# EAGLE design headlightsV1_6 (EAGLE 7.5.0)
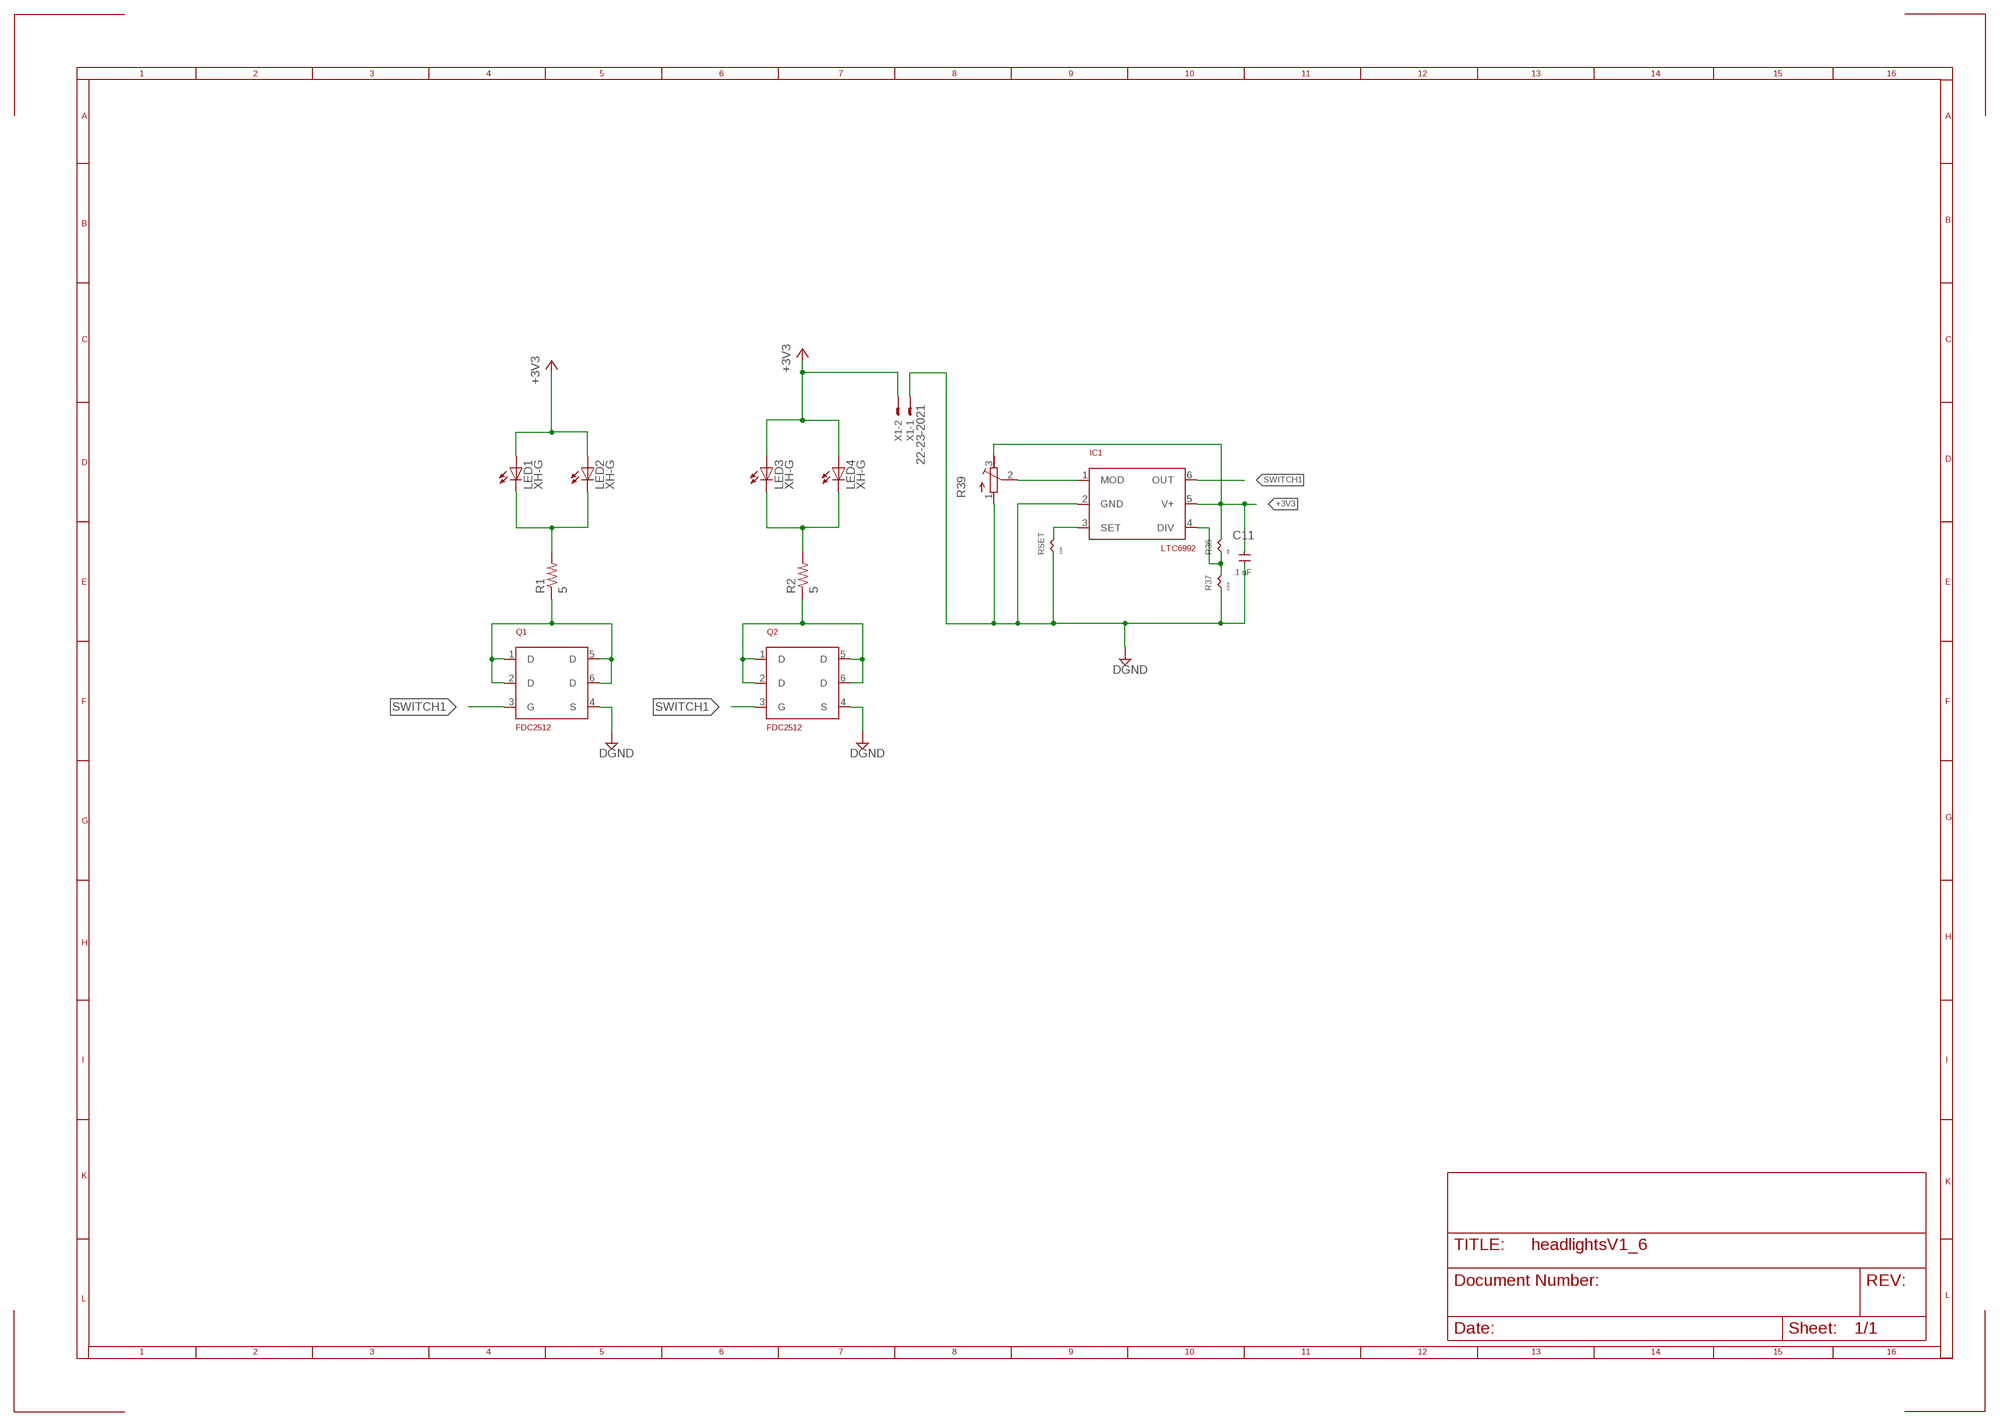
[diagram p0: schematic, sheet 1]

## Parts
C11  .1 uF  C-ERC0402  [C0402]
IC1  LTC6992  [TSOT-23-6]
LED1  XH-G  [XH-G]
LED2  XH-G  [XH-G]
LED3  XH-G  [XH-G]
LED4  XH-G  [XH-G]
Q1  FDC2512  [SSOT6]
Q2  FDC2512  [SSOT6]
R1  5  R-US_R0805  [R0805]
R2  5  R-US_R0805  [R0805]
R36  10k  R-ER-TINYR402  [R0402]
R37  6.81k  R-ER-TINYR402  [R0402]
R39  R-TRIMM3304W  [RTRIM3304W]
RSET  122k  R-ER-TINYR402  [R0402]
X1  22-23-2021  [22-23-2021]

## Nets
+3V3: C11.2 IC1.5(V+) LED1.2(A) LED2.2(A) LED3.2(A) LED4.2(A) R36.2 R39.3(A) X1.2
DGND: C11.1 IC1.2(GND) Q1.4(S) Q2.4(S) R37.1 R39.1(E) RSET.1 X1.1
N$1: Q1.1(D) Q1.2(D) Q1.5(D) Q1.6(D) R1.1
N$4: Q2.1(D) Q2.2(D) Q2.5(D) Q2.6(D) R2.1
N$39: LED3.1(C) LED4.1(C) R2.2
N$41: IC1.4(DIV) R36.1 R37.2
N$43: IC1.3(SET) RSET.2
N$45: IC1.1(MOD) R39.2(S)
N$57: LED1.1(C) LED2.1(C) R1.2
SWITCH1: IC1.6(OUT) Q1.3(G) Q2.3(G)

## Library data of the parts
C11 = rcl:C-ER
IC1 = linear-technology:LTC6992
LED1-LED4 = led:XH-G
Q1 Q2 = transistor-fet:FDC2512
R1 R2 = rcl:R-US_: RESISTOR, American symbol
R36 R37 RSET = rcl:R-ER-TINY
R39 = rcl:R-TRIMM: Trimm resistor
X1 = con-molex:22-23-2021: .100" (2.54mm) Center Header - 2 Pin

## Board
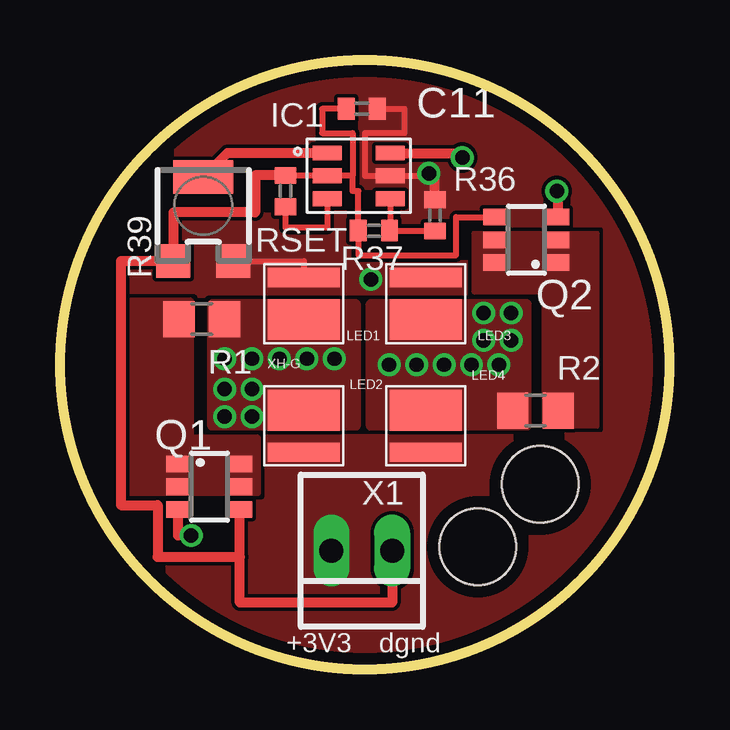
[diagram p1: board, top side]
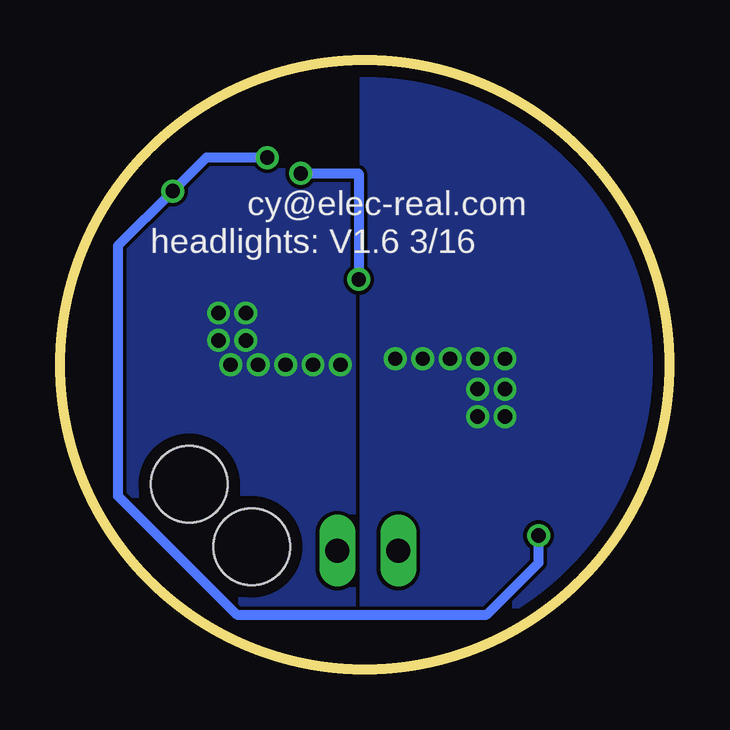
[diagram p2: board, bottom side, seen from below]

Size 25.4 x 25.4 mm. Coordinates in mm from the lower left corner, seen from the top.
Outline: 12.7,0 arc90 25.4,12.7 arc90 12.7,25.4 arc90 0,12.7 arc90 12.7,0
Outline: circle at 12.7,12.7 radius 12.7
Copper layers (1*16): Top 0.0356mm / dielectric 1.5011mm / Bottom 0.0356mm
Design rules "LaenPCBOrder *": minimum track width 6mil, minimum drill 13mil, track to track 6mil, track to pad 6mil, pad to pad 6mil, via to via 6mil, smd to smd 6mil, copper to edge 20mil, drill to drill 6mil, minimum pad ring 7mil, minimum via ring 7mil, stop-mask expansion 3mil, vias tented up to drill 0mil, thermal gap 10mil
Holes 3.2 mm at 17.41,5.12 20.02,7.73
Milling: 2 lines

### Footprints (pad centres in the part's own frame; a part is rotated, then mirrored left to right if it is on the bottom)
C0402 = smd 0.7 x 0.9: 1 -0.65,0; 2 0.65,0
TSOT-23-6 = smd 0.62 x 1.22: 1 -0.95,-1.31; 2 0,-1.31; 3 0.95,-1.31; 4 0.95,1.31; 5 0,1.31; 6 -0.95,1.31
XH-G = smd 1.7 x 3: 1 -0.65,0 | smd 0.8 x 3: 2 1.1,0
SSOT6 = smd 0.69 x 0.99: 1 -0.95,-1.3; 2 0,-1.3; 3 0.95,-1.3; 4 0.95,1.3; 5 0,1.3; 6 -0.95,1.3
R0805 = smd 1.3 x 1.5: 1 -0.95,0; 2 0.95,0
R0402 = smd 0.7 x 0.9: 1 -0.65,0; 2 0.65,0
RTRIM3304W = smd 1.4 x 1.4: 1 -1.25,-1.9; 3 1.25,-1.9 | smd 2.5 x 1.4: 2 0,1.6
22-23-2021 = drill 1 long: 1 -1.27,0; 2 1.27,0

### Placement (x,y rotation side)
C11  12.57,23.37 0 top
IC1  12.45,20.57 270 top
LED1  10.16,15.24 90 top
LED2  10.16,10.16 270 top
LED3  15.24,15.24 90 top
LED4  15.24,10.16 270 top
Q1  6.22,7.62 270 top
Q2  19.43,17.91 90 top
R1  5.91,14.61 0 top
R2  19.81,10.79 180 top
R36  15.62,18.92 90 top
R37  13.08,18.29 0 top
R39  5.97,18.92 0 top
RSET  9.4,19.94 270 top
X1  12.57,4.95 180 top

### Tracks (layer width: path | path; a pad name or v marks a point on that pad's centre or on a via)
+3V3  (via drill 0.6)
  Top 0.254: C11.2 14.35,23.37 14.35,22.35 12.7,22.35 12.7,20.57 IC1.5 15.62,20.57 15.62,20.65 | R39.3 10.16,17.02 LED1.2
  Top 0.406: R36.2 15.62,20.65 v15.37,20.68
  Bottom 0.406: v15.37,20.68 12.95,20.68 v12.95,16.26
  pour Top (rank 2, no thermals): 0.13,0 25.4,0 25.4,25.4 0.13,25.4
DGND
  Top 0.254: RSET.1 11.14,20.59 | C11.1 10.92,23.37 10.92,22.35 12.19,22.35 12.19,20.57 | 12.19,20.57 IC1.2 | 12.19,20.57 12.19,19.94 12.43,19.94 R37.1 12.43,17.27 16.51,17.27 16.51,18.86 Q2.4 | 7.49,6.67 Q1.4
  Top 0.406: 11.14,20.59 IC1.2 | RSET.1 8.13,20.59 8.13,19.05 4.72,19.05 R39.1 2.54,17.02 2.54,6.86 4.06,6.86 4.06,4.7 7.49,4.7 | 7.49,4.7 7.49,6.67 | X1.1 13.84,2.79 7.49,2.79 7.49,4.7
N$1
  pour Top (no thermals): 2.92,15.37 2.92,7.37 8.26,7.37 8.26,9.65 5.46,9.65 5.46,15.37
N$4
  pour Top (no thermals): 22.35,18.16 22.35,10.16 20.19,10.16 20.19,15.75 17.27,15.75 17.27,18.16
N$39  (via drill 0.6)
  other vias: 13.72,12.7 14.86,12.7 16,12.7 17.14,12.7 18.29,12.7 18.8,13.72 17.65,13.72 17.65,14.86 18.8,14.86
  pour Top (no thermals): 17.27,15.24 19.43,15.24 19.43,10.29 19.43,10.16 12.95,10.16 12.95,15.24
  pour Bottom (rank 2, no thermals): 12.95,0 25.4,0 25.4,25.4 12.95,25.4
N$41
  Top 0.254: IC1.4 13.76,18.29 15.62,18.29 R36.1
  Top 0.406: 13.76,18.29 R37.2
N$43
  Top 0.254: IC1.3 11.14,18.41 9.4,18.41 RSET.2
N$45
  Top 0.406: IC1.1 6.97,21.52 R39.2
N$57  (via drill 0.6)
  other vias: 6.86,12.95 8,12.95 9.14,12.95 10.29,12.95 11.43,12.95 6.86,11.68 8,11.68 6.86,10.54 8,10.54
  pour Top (no thermals): 6.35,15.24 12.32,15.24 12.32,10.16 6.35,10.16
  pour Bottom (no thermals): 0,0 12.7,0 12.7,25.4 0,25.4
SWITCH1  (via drill 0.6)
  Top 0.406: IC1.6 16.58,21.52 v16.76,21.34 | v5.46,5.59 4.92,5.59 Q1.3 | v20.7,19.94 20.73,19.94 Q2.3
  Bottom 0.406: v16.76,21.34 19.3,21.34 v20.7,19.94 22.99,17.65 22.99,7.24 18.03,2.29 7.62,2.29 5.46,4.45 v5.46,5.59

### Text on the board
tPlace: +3V3 | dgnd
bPlace: cy@elec-real.com | headlights: V1.6 3/16